# EAGLE schematic indego_adapter (EAGLE 9.6.2)

## Sheet 1 of 2
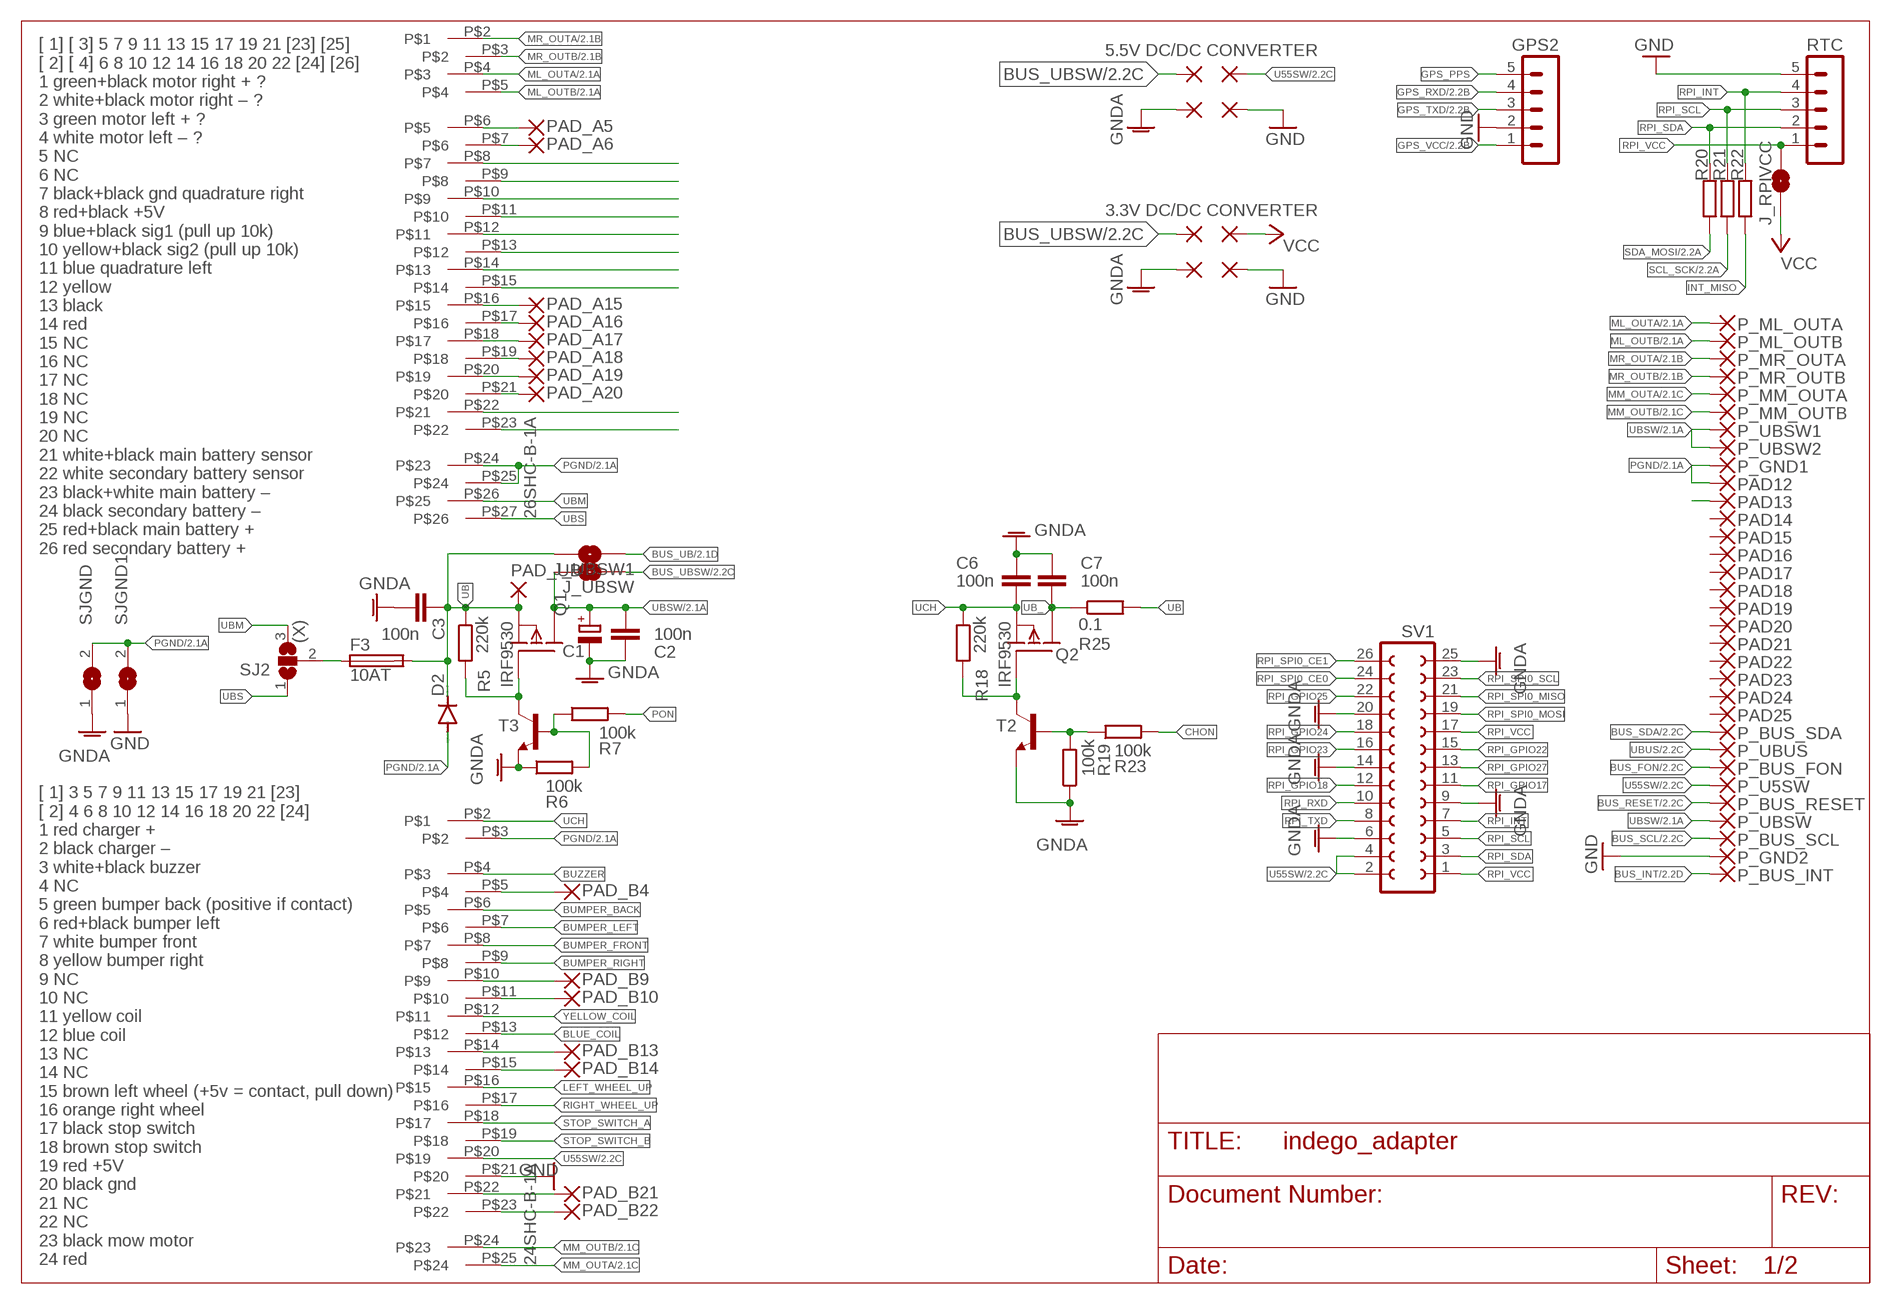
[diagram p0: schematic, sheet 1]

### Parts
C1  CPOL-EUE7.5-16  [E7,5-16]
C2  100n  C-EUC0805  [C0805]
C3  100n  C-EUC0805  [C0805]
C6  100n  C-EUC0805  [C0805]
C7  100n  C-EUC0805  [C0805]
D2  DIODE-MELF-MLL41  [MELF-MLL41]
DC_GND1  2,54/1,0  [2,54/1,0]
DC_GND2  2,54/1,0  [2,54/1,0]
DC_GND3  2,54/1,0  [2,54/1,0]
DC_GND4  2,54/1,0  [2,54/1,0]
DC_VIN1  2,54/1,0  [2,54/1,0]
DC_VIN2  2,54/1,0  [2,54/1,0]
F3  10AT  FUSESH22,5A  [SH22,5A]
GPS2  MA05-1  [MA05-1]
J_RPIVCC  JUMPER-SMT_2_NO_NO-SILK  [SMT-JUMPER_2_NO_NO-SILK]
J_UBSW  JUMPER-SMT_2_NO_NO-SILK  [SMT-JUMPER_2_NO_NO-SILK]
J_UBSW1  JUMPER-SMT_2_NO_NO-SILK  [SMT-JUMPER_2_NO_NO-SILK]
P_BUS_FON  2,15/1,0  [2,15/1,0]
P_BUS_INT  2,15/1,0  [2,15/1,0]
P_BUS_RESET  2,15/1,0  [2,15/1,0]
P_BUS_SCL  2,15/1,0  [2,15/1,0]
P_BUS_SDA  2,15/1,0  [2,15/1,0]
P_GND1  2,15/1,0  [2,15/1,0]
P_GND2  2,15/1,0  [2,15/1,0]
P_ML_OUTA  2,15/1,0  [2,15/1,0]
P_ML_OUTB  2,15/1,0  [2,15/1,0]
P_MM_OUTA  2,15/1,0  [2,15/1,0]
P_MM_OUTB  2,15/1,0  [2,15/1,0]
P_MR_OUTA  2,15/1,0  [2,15/1,0]
P_MR_OUTB  2,15/1,0  [2,15/1,0]
P_U5SW  2,15/1,0  [2,15/1,0]
P_UBSW  2,15/1,0  [2,15/1,0]
P_UBSW1  2,15/1,0  [2,15/1,0]
P_UBSW2  2,15/1,0  [2,15/1,0]
P_UBUS  2,15/1,0  [2,15/1,0]
PAD12  2,15/1,0  [2,15/1,0]
PAD13  2,15/1,0  [2,15/1,0]
PAD14  2,15/1,0  [2,15/1,0]
PAD15  2,15/1,0  [2,15/1,0]
PAD16  2,15/1,0  [2,15/1,0]
PAD17  2,15/1,0  [2,15/1,0]
PAD18  2,15/1,0  [2,15/1,0]
PAD19  2,15/1,0  [2,15/1,0]
PAD20  2,15/1,0  [2,15/1,0]
PAD21  2,15/1,0  [2,15/1,0]
PAD22  2,15/1,0  [2,15/1,0]
PAD23  2,15/1,0  [2,15/1,0]
PAD24  2,15/1,0  [2,15/1,0]
PAD25  2,15/1,0  [2,15/1,0]
PAD_A5  1,6/0,9  [1,6/0,9]
PAD_A6  1,6/0,9  [1,6/0,9]
PAD_A15  1,6/0,9  [1,6/0,9]
PAD_A16  1,6/0,9  [1,6/0,9]
PAD_A17  1,6/0,9  [1,6/0,9]
PAD_A18  1,6/0,9  [1,6/0,9]
PAD_A19  1,6/0,9  [1,6/0,9]
PAD_A20  1,6/0,9  [1,6/0,9]
PAD_B4  1,6/0,9  [1,6/0,9]
PAD_B9  1,6/0,9  [1,6/0,9]
PAD_B10  1,6/0,9  [1,6/0,9]
PAD_B13  1,6/0,9  [1,6/0,9]
PAD_B14  1,6/0,9  [1,6/0,9]
PAD_B21  1,6/0,9  [1,6/0,9]
PAD_B22  1,6/0,9  [1,6/0,9]
PAD_UB  3,17/1,3  [3,17/1,3]
Q1  IRF9530  [TO220]
Q2  IRF9530  [TO220]
R5  220k  R-EU_R0805  [R0805]
R6  100k  R-EU_R0805  [R0805]
R7  100k  R-EU_R0805  [R0805]
R18  220k  R-EU_R0805  [R0805]
R19  100k  R-EU_R0805  [R0805]
R20  R-EU_M0805  [M0805]
R21  R-EU_M0805  [M0805]
R22  R-EU_M0805  [M0805]
R23  100k  R-EU_R0805  [R0805]
R25  0.1  R-EU_R2512  [R2512]
RTC  MA05-1  [MA05-1]
SJ2  SJ2W  [SJ_2]
SJGND  SJ  [SJ]
SJGND1  SJ  [SJ]
SV1  FE13-2  [FE13-2]
T2  BC817-16-NPN-SOT23-BEC  [SOT23-BEC]
T3  BC817-16-NPN-SOT23-BEC  [SOT23-BEC]
U55SW  2,54/1,0  [2,54/1,0]
U$1  26SHC-B-1A  [26SHC-B-1A]
U$3  24SHC-B-1A  [24SHC-B-1A]
VCC  2,54/1,0  [2,54/1,0]

### Nets
BLUE_COIL: U$3.P$13
BUMPER_BACK: U$3.P$6
BUMPER_FRONT: U$3.P$8
BUMPER_LEFT: U$3.P$7
BUMPER_RIGHT: U$3.P$9
BUS_FON: P_BUS_FON.1(P) ; also sheet 2
BUS_INT: P_BUS_INT.1(P) ; also sheet 2
BUS_RESET: P_BUS_RESET.1(P) ; also sheet 2
BUS_SCL: P_BUS_SCL.1(P) ; also sheet 2
BUS_SDA: P_BUS_SDA.1(P) ; also sheet 2
BUS_UB [3A]: J_UBSW1.2 ; also sheet 2
BUS_UBSW [3A]: DC_VIN1.1(P) DC_VIN2.1(P) J_UBSW.2 ; also sheet 2
BUZZER: U$3.P$4
CHON: R23.2
GND: DC_GND2.1(P) DC_GND4.1(P) GPS2.2 P_GND2.1(P) RTC.5 SJGND1.1 U$3.P$21 ; also sheet 2
GNDA [3A]: C1.- C2.2 C3.2 C6.1 C7.1 DC_GND1.1(P) DC_GND3.1(P) R6.1 R19.1 SJGND.1 SV1.6 SV1.9 SV1.14 SV1.20 SV1.25 T2.E T3.E
GPS_PPS: GPS2.5
GPS_RXD: GPS2.4 ; also sheet 2
GPS_TXD: GPS2.3 ; also sheet 2
GPS_VCC: GPS2.1 ; also sheet 2
INT_MISO: R22.1
LEFT_WHEEL_UP: U$3.P$16
ML_OUTA [3A]: P_ML_OUTA.1(P) U$1.P$4 ; also sheet 2
ML_OUTB [3A]: P_ML_OUTB.1(P) U$1.P$5 ; also sheet 2
MM_OUTA [10A]: P_MM_OUTA.1(P) U$3.P$25 ; also sheet 2
MM_OUTB [10A]: P_MM_OUTB.1(P) U$3.P$24 ; also sheet 2
MR_OUTA [3A]: P_MR_OUTA.1(P) U$1.P$2 ; also sheet 2
MR_OUTB [3A]: P_MR_OUTB.1(P) U$1.P$3 ; also sheet 2
N$1: U$1.P$22
N$3: Q2.1(G) R18.2 T2.C
N$4: PAD_B4.1(P) U$3.P$5
N$5: PAD_A5.1(P) U$1.P$6
N$6: PAD_A6.1(P) U$1.P$7
N$7: U$1.P$8
N$8: U$1.P$9
N$9: U$1.P$10
N$10: U$1.P$11
N$11: U$1.P$12
N$12: U$1.P$13
N$13: U$1.P$14
N$14: U$1.P$15
N$15: PAD_A15.1(P) U$1.P$16
N$16: PAD_A16.1(P) U$1.P$17
N$17: PAD_A17.1(P) U$1.P$18
N$18: PAD_A18.1(P) U$1.P$19
N$19: PAD_A19.1(P) U$1.P$20
N$20: PAD_A20.1(P) U$1.P$21
N$22: U$1.P$23
N$28: PAD_B9.1(P) U$3.P$10
N$30: PAD_B10.1(P) U$3.P$11
N$31: R6.2 R7.1 T3.B
N$32: Q1.1(G) R5.2 T3.C
N$38: PAD13.1(P)
N$40: PAD_B13.1(P) U$3.P$14
N$41: PAD_B14.1(P) U$3.P$15
N$48: PAD_B21.1(P) U$3.P$22
N$49: PAD_B22.1(P) U$3.P$23
N$65: R19.2 R23.1 T2.B
PGND [10A]: D2.A P_GND1.1(P) PAD12.1(P) SJGND1.2 SJGND.2 U$1.P$24 U$1.P$25 U$3.P$3 ; also sheet 2
PON: R7.2
RIGHT_WHEEL_UP: U$3.P$17
RPI_GPIO17: SV1.11
RPI_GPIO18: SV1.12
RPI_GPIO22: SV1.15
RPI_GPIO23: SV1.16
RPI_GPIO24: SV1.18
RPI_GPIO25: SV1.22
RPI_GPIO27: SV1.13
RPI_INT: R22.2 RTC.4 SV1.7
RPI_RXD: SV1.10
RPI_SCL: R21.2 RTC.3 SV1.5
RPI_SDA: R20.2 RTC.2 SV1.3
RPI_SPI0_CE0: SV1.24
RPI_SPI0_CE1: SV1.26
RPI_SPI0_MISO: SV1.21
RPI_SPI0_MOSI: SV1.19
RPI_SPI0_SCL: SV1.23
RPI_TXD: SV1.8
RPI_VCC [vcc]: J_RPIVCC.1 RTC.1 SV1.1 SV1.17
SCL_SCK: R21.1 ; also sheet 2
SDA_MOSI: R20.1 ; also sheet 2
STOP_SWITCH_A: U$3.P$18
STOP_SWITCH_B: U$3.P$19
U55SW [3A]: P_U5SW.1(P) SV1.2 SV1.4 U55SW.1(P) U$3.P$20 ; also sheet 2
UB [10A]: C3.1 D2.C F3.2 J_UBSW1.1 PAD_UB.1(P) Q1.3(S) R5.1 R25.2
UB_ [10A]: C7.2 Q2.2(D) R25.1
UBM [10A]: SJ2.3 U$1.P$26
UBS [10A]: SJ2.1 U$1.P$27
UBSW [10A]: C1.+ C2.1 J_UBSW.1 P_UBSW1.1(P) P_UBSW2.1(P) P_UBSW.1(P) Q1.2(D) ; also sheet 2
UBUS [3A]: P_UBUS.1(P) ; also sheet 2
UBX [10A]: F3.1 SJ2.2
UCH [10A]: C6.2 Q2.3(S) R18.1 U$3.P$2
VCC [vcc]: J_RPIVCC.2 VCC.1(P) ; also sheet 2
YELLOW_COIL: U$3.P$12
Unconnected: PAD14.1(P) PAD15.1(P) PAD16.1(P) PAD17.1(P) PAD18.1(P) PAD19.1(P) PAD20.1(P) PAD21.1(P) PAD22.1(P) PAD23.1(P) PAD24.1(P) PAD25.1(P)

### Notes on the sheet
- 5.5V DC/DC CONVERTER
- 3.3V DC/DC CONVERTER
- [ 1] [ 3] 5 7 9 11 13 15 17 19 21 [23] [25]
  [ 2] [ 4] 6 8 10 12 14 16 18 20 22 [24] [26]
  1 green+black motor right + ?
  2 white+black motor right – ?
  3 green motor left + ?
  4 white motor left – ?
  5 NC
  6 NC
  7 black+black gnd quadrature right
  8 red+black +5V
  9 blue+black sig1 (pull up 10k)
  10 yellow+black sig2 (pull up 10k)
  11 blue quadrature left
  12 yellow
  13 black
  14 red
  15 NC
  16 NC
  17 NC
  18 NC
  19 NC
  20 NC
  21 white+black main battery sensor
  22 white secondary battery sensor
  23 black+white main battery –
  24 black secondary battery –
  25 red+black main battery +
  26 red secondary battery +
- (X)
- [ 1] 3 5 7 9 11 13 15 17 19 21 [23]
  [ 2] 4 6 8 10 12 14 16 18 20 22 [24]
  1 red charger +
  2 black charger –
  3 white+black buzzer
  4 NC
  5 green bumper back (positive if contact)
  6 red+black bumper left
  7 white bumper front
  8 yellow bumper right
  9 NC
  10 NC
  11 yellow coil
  12 blue coil
  13 NC
  14 NC
  15 brown left wheel (+5v = contact, pull down)
  16 orange right wheel
  17 black stop switch
  18 brown stop switch
  19 red +5V
  20 black gnd
  21 NC
  22 NC
  23 black mow motor
  24 red

## Sheet 2 of 2
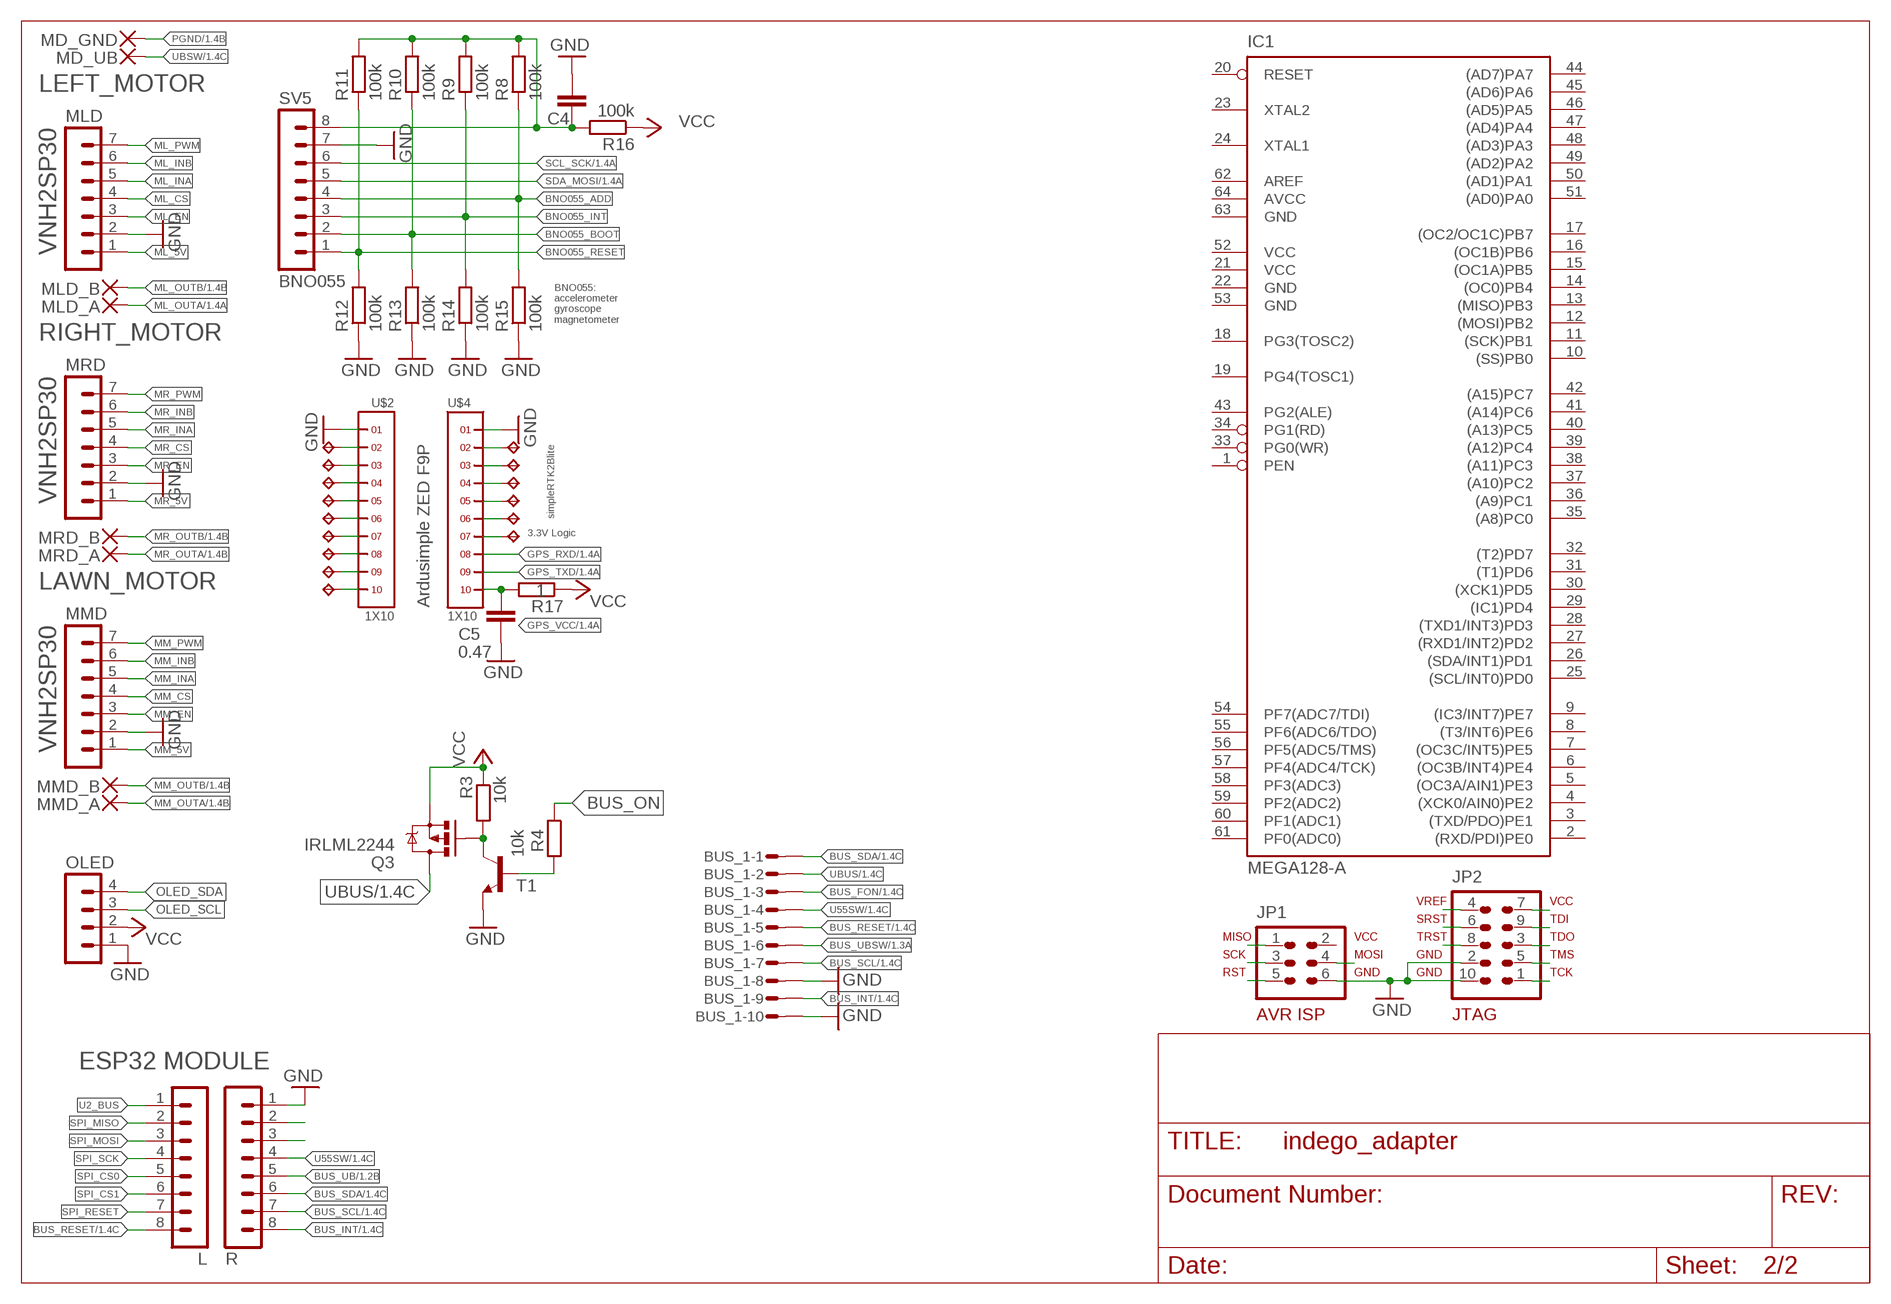
[diagram p1: schematic, sheet 2]

### Parts
BUS_1  I2CBUS  MICROMATCH-10SMD  [MICROMATCH-10SMD]
C4  C-EUC0805  [C0805]
C5  0.47  C-EUC0805  [C0805]
IC1  MEGA128-A  [TQFP64]
JP1  AVR-ISP-6VERT  [AVR-ISP-6]
JP2  AVR-JTAG-10  [AVR-JTAG-10]
L  MA08-1  [MA08-1]
MD_GND  3,17/1,3  [3,17/1,3]
MD_UB  3,17/1,3  [3,17/1,3]
MLD  MA07-1  [MA07-1]
MLD_A  3,17/1,3  [3,17/1,3]
MLD_B  3,17/1,3  [3,17/1,3]
MMD  MA07-1  [MA07-1]
MMD_A  3,17/1,3  [3,17/1,3]
MMD_B  3,17/1,3  [3,17/1,3]
MRD  MA07-1  [MA07-1]
MRD_A  3,17/1,3  [3,17/1,3]
MRD_B  3,17/1,3  [3,17/1,3]
OLED  MA04-1  [MA04-1]
Q3  IRLML2244  MOSFET-PCHANNELIRLML2244  [SOT23-3]
R  MA08-1  [MA08-1]
R3  10k  R-EU_R0805  [R0805]
R4  10k  R-EU_R0805  [R0805]
R8  100k  R-EU_M0805  [M0805]
R9  100k  R-EU_M0805  [M0805]
R10  100k  R-EU_M0805  [M0805]
R11  100k  R-EU_M0805  [M0805]
R12  100k  R-EU_M0805  [M0805]
R13  100k  R-EU_M0805  [M0805]
R14  100k  R-EU_M0805  [M0805]
R15  100k  R-EU_M0805  [M0805]
R16  100k  R-EU_M0805  [M0805]
R17  1  R-EU_M0805  [M0805]
SV5  BNO055  MA08-1  [MA08-1]
T1  BC817-16-NPN-SOT23-BEC  [SOT23-BEC]
TP1  TPB2,54  [B2,54]
TP2  TPB2,54  [B2,54]
TP3  TPB2,54  [B2,54]
TP4  TPB2,54  [B2,54]
TP5  TPB2,54  [B2,54]
TP6  TPB2,54  [B2,54]
TP7  TPB2,54  [B2,54]
TP8  TPB2,54  [B2,54]
TP9  TPB2,54  [B2,54]
TP10  TPB2,54  [B2,54]
TP11  TPB2,54  [B2,54]
TP12  TPB2,54  [B2,54]
TP13  TPB2,54  [B2,54]
TP14  TPB2,54  [B2,54]
TP15  TPB2,54  [B2,54]
U$2  1X10  [1X10]
U$4  1X10  [1X10]

### Nets
BNO055_ADD: R8.1 R15.2 SV5.4
BNO055_BOOT: R10.1 R13.2 SV5.2
BNO055_INT: R9.1 R14.2 SV5.3
BNO055_RESET: R11.1 R12.2 SV5.1
BUS_FON: BUS_1.3 ; also sheet 1
BUS_INT: BUS_1.9 R.8 ; also sheet 1
BUS_ON: R4.1
BUS_RESET: BUS_1.5 L.8 ; also sheet 1
BUS_SCL: BUS_1.7 R.7 ; also sheet 1
BUS_SDA: BUS_1.1 R.6 ; also sheet 1
BUS_UB [3A]: R.5 ; also sheet 1
BUS_UBSW [3A]: BUS_1.6 ; also sheet 1
GND: BUS_1.8 BUS_1.10 C4.1 C5.2 JP1.6 JP2.2 JP2.10 MLD.2 MMD.2 MRD.2 OLED.1 R12.1 R13.1 R14.1 R15.1 R.1 SV5.7 T1.E U$2.1 U$4.1 ; also sheet 1
GPS_RXD: U$4.8 ; also sheet 1
GPS_TXD: U$4.9 ; also sheet 1
GPS_VCC: C5.1 R17.2 U$4.10 ; also sheet 1
ML_5V: MLD.1
ML_CS: MLD.4
ML_EN: MLD.3
ML_INA: MLD.5
ML_INB: MLD.6
ML_OUTA [3A]: MLD_A.1(P) ; also sheet 1
ML_OUTB [3A]: MLD_B.1(P) ; also sheet 1
ML_PWM: MLD.7
MM_5V: MMD.1
MM_CS: MMD.4
MM_EN: MMD.3
MM_INA: MMD.5
MM_INB: MMD.6
MM_OUTA [10A]: MMD_A.1(P) ; also sheet 1
MM_OUTB [10A]: MMD_B.1(P) ; also sheet 1
MM_PWM: MMD.7
MR_5V: MRD.1
MR_CS: MRD.4
MR_EN: MRD.3
MR_INA: MRD.5
MR_INB: MRD.6
MR_OUTA [3A]: MRD_A.1(P) ; also sheet 1
MR_OUTB [3A]: MRD_B.1(P) ; also sheet 1
MR_PWM: MRD.7
N$2: TP1.TP U$2.2
N$21: Q3.1(G) R3.2 T1.C
N$23: R4.2 T1.B
N$24 [vcc]: C4.2 R8.2 R9.2 R10.2 R11.2 R16.2 SV5.8
N$25: TP2.TP U$2.3
N$26: TP3.TP U$2.4
N$27: TP4.TP U$2.5
N$29: TP5.TP U$2.6
N$33: TP6.TP U$2.7
N$34: TP7.TP U$2.8
N$42: TP8.TP U$2.9
N$43: TP9.TP U$2.10
N$44: TP10.TP U$4.2
N$45: TP11.TP U$4.3
N$46: TP12.TP U$4.4
N$47: TP13.TP U$4.5
N$50: TP14.TP U$4.6
N$51: TP15.TP U$4.7
N$52: JP1.5
N$53: JP1.3
N$54: JP1.1
N$55: JP1.4
N$56: JP2.8
N$57: JP2.6
N$58: JP2.4
N$59: JP2.7
N$60: JP2.9
N$61: JP2.3
N$62: JP2.5
N$63: JP2.1
OLED_SCL: OLED.3
OLED_SDA: OLED.4
PGND [10A]: MD_GND.1(P) ; also sheet 1
SCL_SCK: SV5.6 ; also sheet 1
SDA_MOSI: SV5.5 ; also sheet 1
SPI_CS0: L.5
SPI_CS1: L.6
SPI_MISO: L.2
SPI_MOSI: L.3
SPI_RESET: L.7
SPI_SCK: L.4
U2_BUS: L.1
U33A [vcc]: R.2
U33B [vcc]: R.3
U55SW [3A]: BUS_1.4 R.4 ; also sheet 1
UBSW [10A]: MD_UB.1(P) ; also sheet 1
UBUS [3A]: BUS_1.2 Q3.3(D) ; also sheet 1
VCC [vcc]: OLED.2 Q3.2(S) R3.1 R16.1 R17.1 ; also sheet 1
Unconnected: IC1.1(PEN) IC1.2((RXD/PDI)PE0) IC1.3((TXD/PDO)PE1) IC1.4((XCK0/AIN0)PE2) IC1.5((OC3A/AIN1)PE3) IC1.6((OC3B/INT4)PE4) IC1.7((OC3C/INT5)PE5) IC1.8((T3/INT6)PE6) IC1.9((IC3/INT7)PE7) IC1.10((SS)PB0) IC1.11((SCK)PB1) IC1.12((MOSI)PB2) IC1.13((MISO)PB3) IC1.14((OC0)PB4) IC1.15((OC1A)PB5) IC1.16((OC1B)PB6) IC1.17((OC2/OC1C)PB7) IC1.18(PG3(TOSC2)) IC1.19(PG4(TOSC1)) IC1.20(RESET) IC1.23(XTAL2) IC1.24(XTAL1) IC1.25((SCL/INT0)PD0) IC1.26((SDA/INT1)PD1) IC1.27((RXD1/INT2)PD2) IC1.28((TXD1/INT3)PD3) IC1.29((IC1)PD4) IC1.30((XCK1)PD5) IC1.31((T1)PD6) IC1.32((T2)PD7) IC1.33(PG0(WR)) IC1.34(PG1(RD)) IC1.35((A8)PC0) IC1.36((A9)PC1) IC1.37((A10)PC2) IC1.38((A11)PC3) IC1.39((A12)PC4) IC1.40((A13)PC5) IC1.41((A14)PC6) IC1.42((A15)PC7) IC1.43(PG2(ALE)) IC1.44((AD7)PA7) IC1.45((AD6)PA6) IC1.46((AD5)PA5) IC1.47((AD4)PA4) IC1.48((AD3)PA3) IC1.49((AD2)PA2) IC1.50((AD1)PA1) IC1.51((AD0)PA0) IC1.54(PF7(ADC7/TDI)) IC1.55(PF6(ADC6/TDO)) IC1.56(PF5(ADC5/TMS)) IC1.57(PF4(ADC4/TCK)) IC1.58(PF3(ADC3)) IC1.59(PF2(ADC2)) IC1.60(PF1(ADC1)) IC1.61(PF0(ADC0)) IC1.62(AREF) JP1.2

### Notes on the sheet
- LEFT_MOTOR
- VNH2SP30
- BNO055:
  accelerometer
  gyroscope
  magnetometer
- RIGHT_MOTOR
- VNH2SP30
- simpleRTK2Blite
- 3.3V Logic
- LAWN_MOTOR
- Ardusimple ZED F9P
- VNH2SP30
- ESP32 MODULE

## Power pins joined to a net without a drawn wire
AVCC: IC1.64(AVCC)
GND: IC1.22(GND) IC1.53(GND) IC1.63(GND)
VCC: IC1.21(VCC) IC1.52(VCC)

## Library data of the parts
BUS_1 = con-amp-micromatch:MICROMATCH-10: MicroMaTch 10 8-215464-0 / 1-215464-0 Drawing Number C-215464 DDEController.pdf
C1 = rcl:CPOL-EU: POLARIZED CAPACITOR, European symbol; SPICEPREFIX: C
C2-C7 = rcl:C-EU: CAPACITOR, European symbol; SPICEPREFIX: C
D2 = diode:DIODE-: DIODE
DC_GND1-DC_GND4 DC_VIN1 DC_VIN2 U55SW VCC = wirepad:2,54/1,0: THROUGH-HOLE PAD
F3 = fuse:FUSE: Fuse; OC_FARNELL: unknown; OC_NEWARK: unknown
GPS2 RTC = con-lstb:MA05-1: PIN HEADER; OC_FARNELL: unknown; OC_NEWARK: unknown
IC1 = atmel:MEGA128: MICROCONTROLLER 128 Kbytes FLASH 4 Kbytes SRAM 4 Kbytes EEPROM DUAL USART 8-channel 10 bit ADC Source: avr.lbr; MPN: ATMEGA128-16AU; OC_FARNELL: 9171118; OC_NEWARK: 95K7364
J_RPIVCC J_UBSW J_UBSW1 = SparkFun-Jumpers:JUMPER-SMT_2_NO: Normally open jumper This jumper has two pads in close proximity to each other. Apply solder to close the connection. Round pads are easier to solder for beginners, but are a lot larger. SparkFun Product that uses the round pads: SparkFun EL Sequencer <https://www.sparkfun.com/products/12781>
JP1 = avr-7:AVR-ISP-6: AVR ISP-6 Serial Programming Header
JP2 = avr-7:AVR-JTAG-10: AVR JTAG Debug/Programming Header
L R SV5 = con-lstb:MA08-1: PIN HEADER; OC_FARNELL: unknown; OC_NEWARK: unknown
MD_GND MD_UB MLD_A MLD_B MMD_A MMD_B MRD_A MRD_B PAD_UB = wirepad:3,17/1,3: THROUGH-HOLE PAD
MLD MMD MRD = con-lstb:MA07-1: PIN HEADER; OC_FARNELL: unknown; OC_NEWARK: unknown
OLED = con-lstb:MA04-1: PIN HEADER; OC_FARNELL: unknown; OC_NEWARK: unknown
P_BUS_FON P_BUS_INT P_BUS_RESET P_BUS_SCL P_BUS_SDA P_GND1 P_GND2 P_ML_OUTA P_ML_OUTB P_MM_OUTA P_MM_OUTB P_MR_OUTA P_MR_OUTB P_U5SW P_UBSW P_UBSW1 P_UBSW2 P_UBUS PAD12-PAD25 = wirepad:2,15/1,0: THROUGH-HOLE PAD
PAD_A5 PAD_A6 PAD_A15-PAD_A20 PAD_B4 PAD_B9 PAD_B10 PAD_B13 PAD_B14 PAD_B21 PAD_B22 = wirepad:1,6/0,9: THROUGH-HOLE PAD
Q1 Q2 = transistor-fet:IRF9530: P-Channel Enhancement MOSFET (HEXFET); -100V; -12A; 0,3Ohm
Q3 = User-Submitted:MOSFET-PCHANNEL: Generic PMOSFET IRLML2244 - TRANS-11153 (SOT-23 -20V -4.3A) (1.Gate 2.Source 3.Drain) FQP27P06 - COM-10349 <http://www.sparkfun.com/products/10349> (TO-220 -60V -27A) (1.Gate 2.Source 3.Drain); PROD_ID: TRANS-11153
R3 R4 R20-R22 R25 = rcl:R-EU_: RESISTOR, European symbol; SPICEPREFIX: R
R5-R19 R23 = rcl:R-EU_: RESISTOR, European symbol
SJ2 = jumper:SJ2W: SMD solder JUMPER
SJGND SJGND1 = jumper:SJ: SMD solder JUMPER
SV1 = con-lsta:FE13-2: FEMALE HEADER; OC_FARNELL: unknown; OC_NEWARK: unknown
T1-T3 = transistor:*-NPN-: NPN Transistror BF959 corrected 2008.03.06
TP1-TP15 = testpad:TP: Test pad
U$1 = shc_con:26SHC-B-1A
U$2 U$4 = headers(2mm):1X10
U$3 = shc_con:24SHC-B-1A

## Net classes
1 gnd: width 0.508 mm, drill 0.254 mm
2 3A: width 1.016 mm, drill 0.635 mm
3 vcc: width 0.254 mm
4 10A: width 2.286 mm, drill 1.524 mm